# EAGLE design CZTBoardV3 (EAGLE 9.6.2)
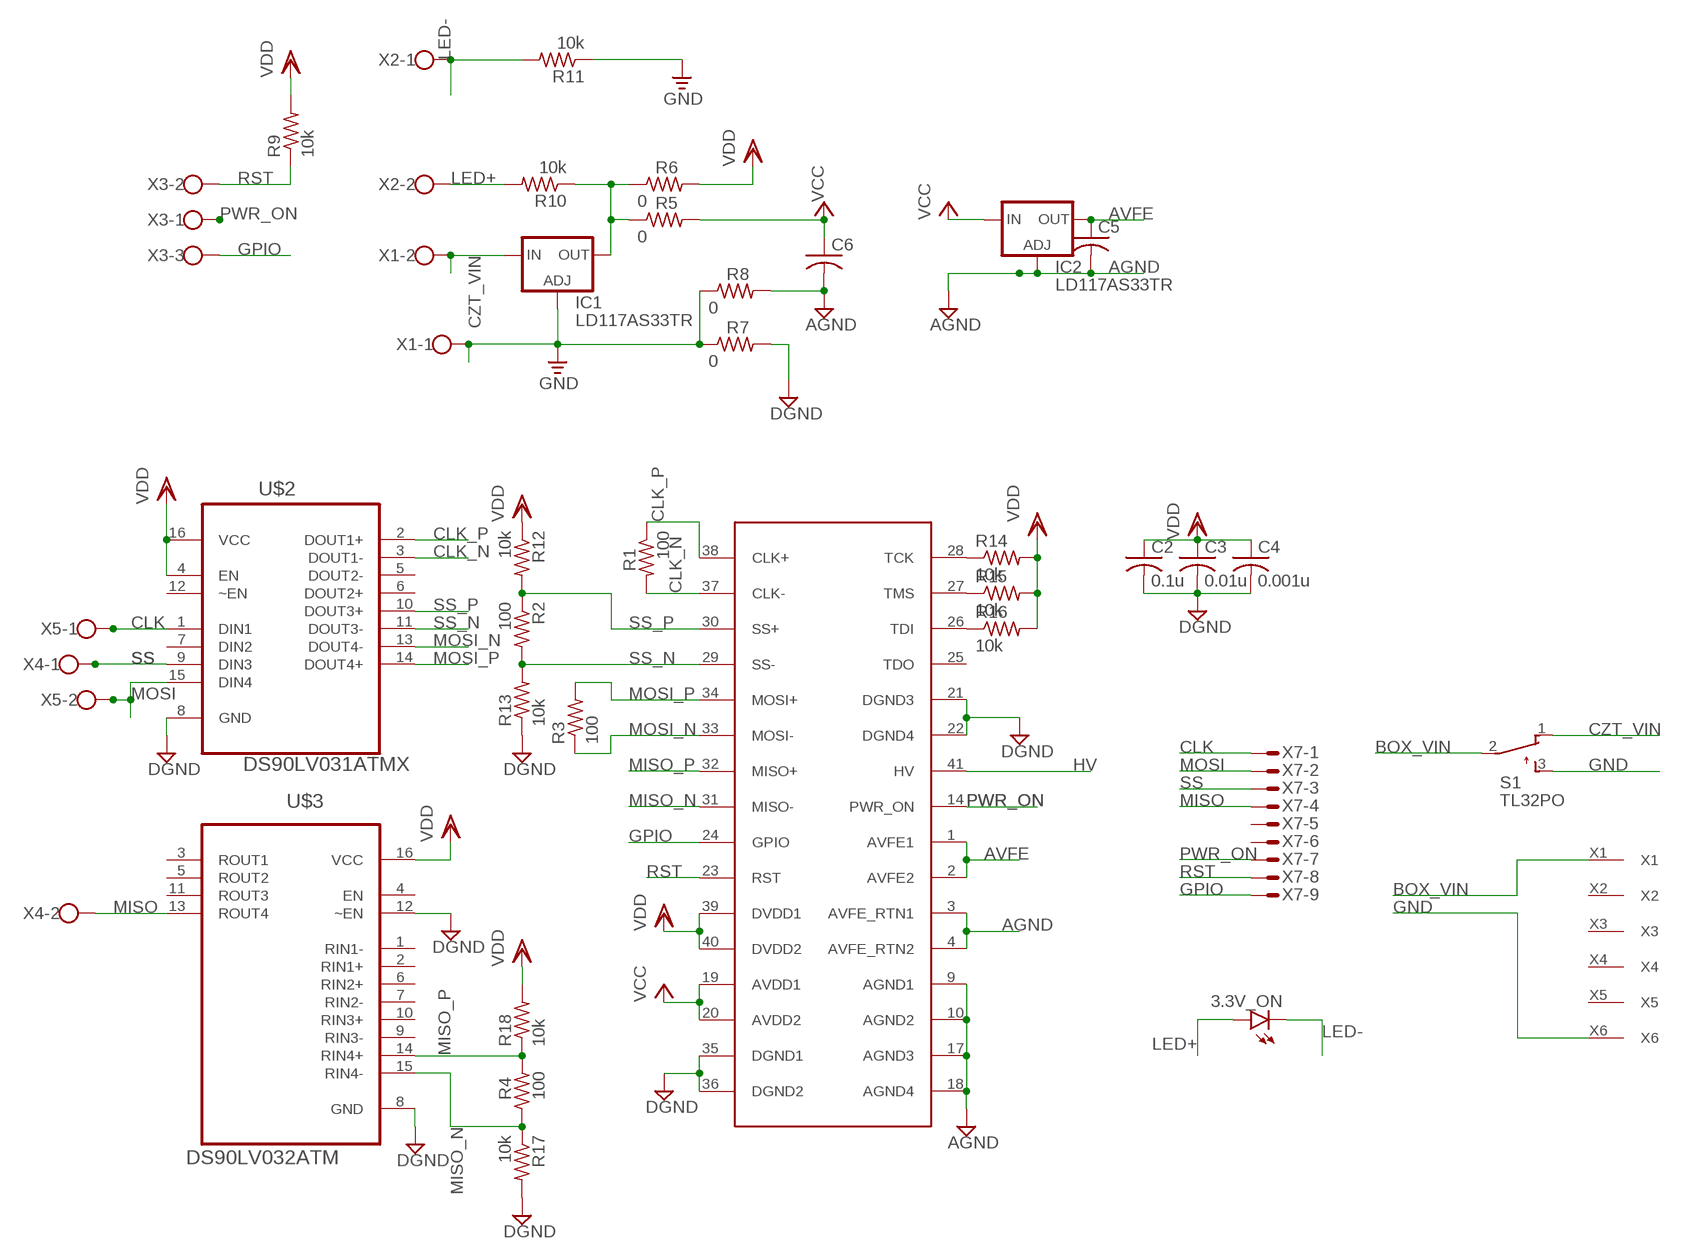
[diagram p0: schematic, sheet 1]

## Parts
3.3V_ON  LED3MM  [LED3MM]
C2  0.1u  C-USC0805K  [C0805K]
C3  0.01u  C-USC0805K  [C0805K]
C4  0.001u  C-USC0805K  [C0805K]
C5  C-USC0805K  [C0805K]
C6  C-USC0805K  [C0805K]
IC1  LD117AS33TR  [SOT223]
IC2  LD117AS33TR  [SOT223]
R1  100  R-US_R1206  [R1206]
R2  100  R-US_R1206  [R1206]
R3  100  R-US_R1206  [R1206]
R4  100  R-US_R1206  [R1206]
R5  0  R-US_R1206  [R1206]
R6  0  R-US_R1206  [R1206]
R7  0  R-US_R1206  [R1206]
R8  0  R-US_R1206  [R1206]
R9  10k  R-US_R1206  [R1206]
R10  10k  R-US_R1206  [R1206]
R11  10k  R-US_R1206  [R1206]
R12  10k  R-US_R1206  [R1206]
R13  10k  R-US_R1206  [R1206]
R14  10k  R-US_R1206  [R1206]
R15  10k  R-US_R1206  [R1206]
R16  10k  R-US_R1206  [R1206]
R17  10k  R-US_R1206  [R1206]
R18  10k  R-US_R1206  [R1206]
S1  TL32PO  [TL3XPO]
U$1  ORBOTECH_OMS40G256  [ORBOTECH_OMS40G256]
U$2  DS90LV031ATMX  [SOIC127P600X175-16N]
U$3  DS90LV032ATM  [SOIC127P600X175-16N]
X1  W237-102  [W237-102]
X2  W237-102  [W237-102]
X3  W237-103  [W237-103]
X4  W237-102  [W237-102]
X5  W237-102  [W237-102]
X6  GX16  [GX16]
X7  M09VS  [M09V]

## Nets
3.3VREG: IC1.4(OUT) R5.1 R6.1 R10.1
AGND: C5.2 C6.2 IC2.1(ADJ) R8.2 U$1.3(AVFE_RTN1) U$1.4(AVFE_RTN2) U$1.9(AGND1) U$1.10(AGND2) U$1.17(AGND3) U$1.18(AGND4)
AVFE: C5.1 IC2.4(OUT) U$1.1(AVFE1) U$1.2(AVFE2)
BOX_VIN: S1.2(P) X6.X1
CLK: U$2.1(DIN1) X5.1 X7.1
CLK_N [Diff_Pairs]: R1.2 U$1.37(CLK-) U$2.3(DOUT1-)
CLK_P [Diff_Pairs]: R1.1 U$1.38(CLK+) U$2.2(DOUT1+)
CZT_VIN: IC1.3(IN) S1.1(O) X1.2
DGND: C2.2 C3.2 C4.2 R7.2 R13.1 R17.2 U$1.21(DGND3) U$1.22(DGND4) U$1.35(DGND1) U$1.36(DGND2) U$2.8(GND) U$3.8(GND) U$3.12(~EN)
GND: IC1.1(ADJ) R7.1 R8.1 R11.1 S1.3(S) X1.1 X6.X6
GPIO: U$1.24(GPIO) X3.3 X7.9
HV: U$1.41(HV)
LED+: 3.3V_ON.A R10.2 X2.2
LED-: 3.3V_ON.K(C) R11.2 X2.1
MISO: U$3.13(ROUT4) X4.2 X7.4
MISO_N [Diff_Pairs]: R4.1 R17.1 U$1.31(MISO-) U$3.15(RIN4-)
MISO_P [Diff_Pairs]: R4.2 R18.1 U$1.32(MISO+) U$3.14(RIN4+)
MOSI: U$2.15(DIN4) X5.2 X7.2
MOSI_N [Diff_Pairs]: R3.1 U$1.33(MOSI-) U$2.13(DOUT4-)
MOSI_P [Diff_Pairs]: R3.2 U$1.34(MOSI+) U$2.14(DOUT4+)
N$1: R14.1 U$1.28(TCK)
N$2: R15.1 U$1.27(TMS)
N$4: R16.1 U$1.26(TDI)
PWR_ON: U$1.14(PWR_ON) X3.1 X7.7
RST: R9.1 U$1.23(RST) X3.2 X7.8
SS: U$2.9(DIN3) X4.1 X7.3
SS_N [Diff_Pairs]: R2.2 R13.2 U$1.29(SS-) U$2.11(DOUT3-)
SS_P [Diff_Pairs]: R2.1 R12.2 U$1.30(SS+) U$2.10(DOUT3+)
VCC: C6.1 IC2.3(IN) R5.2 U$1.19(AVDD1) U$1.20(AVDD2)
VDD: C2.1 C3.1 C4.1 R6.2 R9.2 R12.1 R14.2 R15.2 R16.2 R18.2 U$1.39(DVDD1) U$1.40(DVDD2) U$2.4(EN) U$2.16(VCC) U$3.16(VCC)
Unconnected: U$1.25(TDO) U$2.5(DOUT2-) U$2.6(DOUT2+) U$2.7(DIN2) U$2.12(~EN) U$3.1(RIN1-) U$3.2(RIN1+) U$3.3(ROUT1) U$3.4(EN) U$3.5(ROUT2) U$3.6(RIN2+) U$3.7(RIN2-) U$3.9(RIN3-) U$3.10(RIN3+) U$3.11(ROUT3) X6.X2 X6.X3 X6.X4 X6.X5 X7.5 X7.6

## Library data of the parts
3.3V_ON = led:LED: LED OSRAM: - CHIPLED LG R971, LG N971, LY N971, LG Q971, LY Q971, LO R971, LY R971 LH N974, LH R974 LS Q976, LO Q976, LY Q976 LO Q996 - Hyper CHIPLED LW Q18S LB Q993, LB Q99A, LB R99A - SideLED LS A670, LO A670, LY A670, LG A670, LP A670 LB A673, LV A673, LT A673, LW A673 LH A674 LY A675 LS A676, LA A676, LO A676, LY A676, LW A676 LS A679, LY A679, LG A679 - Hyper Micro SIDELED® LS Y876, LA Y876, LO Y876, LY Y876 LT Y87S - SmartLED LW L88C, LW L88S LB L89C, LB L89S, LG L890 LS L89K, LO L89K, LY L89K LS L896, LA L896, LO L896, LY L896 - TOPLED LS T670, LO T670, LY T670, LG T670, LP T670 LSG T670, LSP T670, LSY T670, LOP T670, LYG T670 LG T671, LOG T671, LSG T671 LB T673, LV T673, LT T673, LW T673 LH T674 LS T676, LA T676, LO T676, LY T676, LB T676, LH T676, LSB T676, LW T676 LB T67C, LV T67C, LT T67C, LS T67K, LO T67K, LY T67K, LW E67C LS E67B, LA E67B, LO E67B, LY E67B, LB E67C, LV E67C, LT E67C LW T67C LS T679, LY T679, LG T679 LS T770, LO T770, LY T770, LG T770, LP T770 LB T773, LV T773, LT T773, LW T773 LH T774 LS E675, LA E675, LY E675, LS T675 LS T776, LA T776, LO T776, LY T776, LB T776 LHGB T686 LT T68C, LB T68C - Hyper Mini TOPLED® LB M676 - Mini TOPLED Santana® LG M470 LS M47K, LO M47K, LY M47K Source: http://www.osram.convergy.de LUXEON: - LUMILED® LXK2-PW12-R00, LXK2-PW12-S00, LXK2-PW14-U00, LXK2-PW14-V00 LXK2-PM12-R00, LXK2-PM12-S00, LXK2-PM14-U00 LXK2-PE12-Q00, LXK2-PE12-R00, LXK2-PE12-S00, LXK2-PE14-T00, LXK2-PE14-U00 LXK2-PB12-K00, LXK2-PB12-L00, LXK2-PB12-M00, LXK2-PB14-N00, LXK2-PB14-P00, LXK2-PB14-Q00 LXK2-PR12-L00, LXK2-PR12-M00, LXK2-PR14-Q00, LXK2-PR14-R00 LXK2-PD12-Q00, LXK2-PD12-R00, LXK2-PD12-S00 LXK2-PH12-R00, LXK2-PH12-S00 LXK2-PL12-P00, LXK2-PL12-Q00, LXK2-PL12-R00 Source: www.luxeon.com KINGBRIGHT: KA-3528ASYC Source: www.kingbright.com
C2-C6 = rcl:C-US: CAPACITOR, American symbol
IC1 IC2 = v-reg:LD117A?*: Low drop fixed and adjustable positive voltage regulators 1 A Source: http://www.st.com/stonline/products/literature/ds/7194/ld1117axx.pdf
R1-R18 = rcl:R-US_: RESISTOR, American symbol
S1 = switch:TL32PO: TINY SWITCH ON - MOM Source: http://www2.produktinfo.conrad.com/datenblaetter/700000-724999/705152-da-01-de-Subminiaturschalter_TL_36YO.pdf
U$1 = Orbotech_OMS40G256:ORBOTECH_OMS40G256
U$2 = DS90LV031ATMX:DS90LV031ATMX
U$3 = DS90LV032ATM:DS90LV032ATM
X1 X2 X4 X5 = con-wago-500:W237-102: WAGO SCREW CLAMP; MPN: 237-102; OC_FARNELL: unknown; OC_NEWARK: 70K9898
X3 = con-wago-500:W237-103: WAGO SCREW CLAMP; MPN: 237-103; OC_FARNELL: unknown; OC_NEWARK: 18M7116
X6 = TI_Downloaded:GX16
X7 = con-subd:M09?S: SUB-D; OC_FARNELL: unknown; OC_NEWARK: unknown

## Net classes
1 Diff_Pairs: width 0.61 mm

## Board
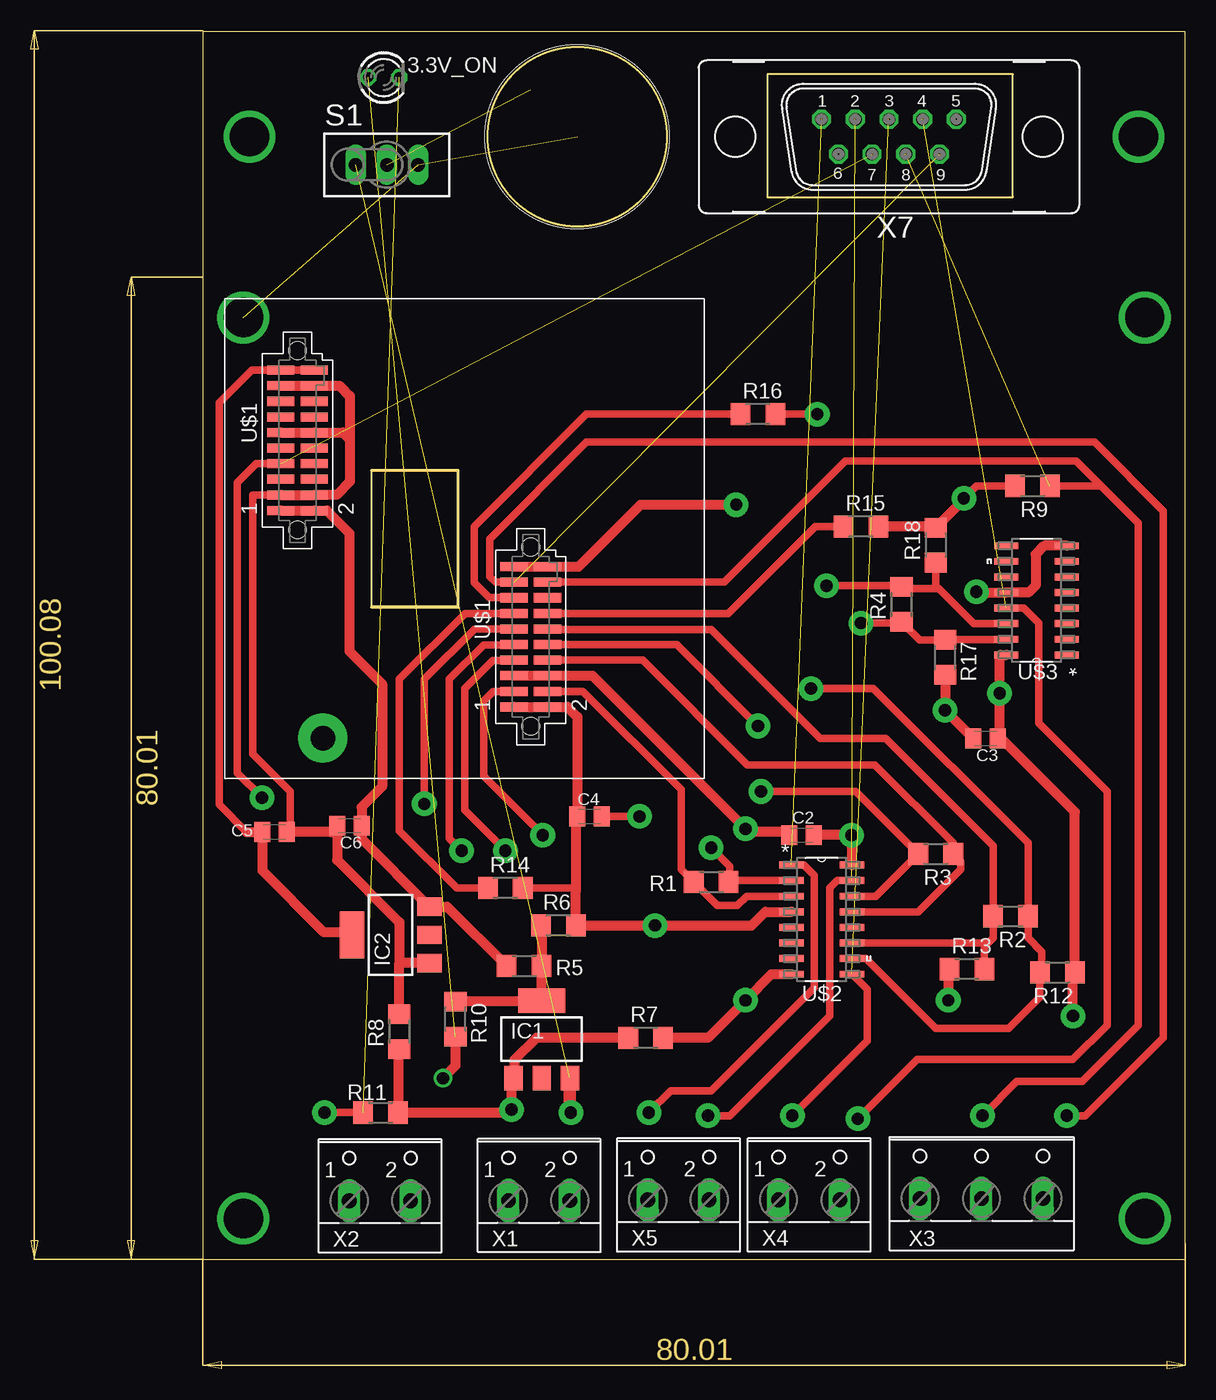
[diagram p1: board, top side]
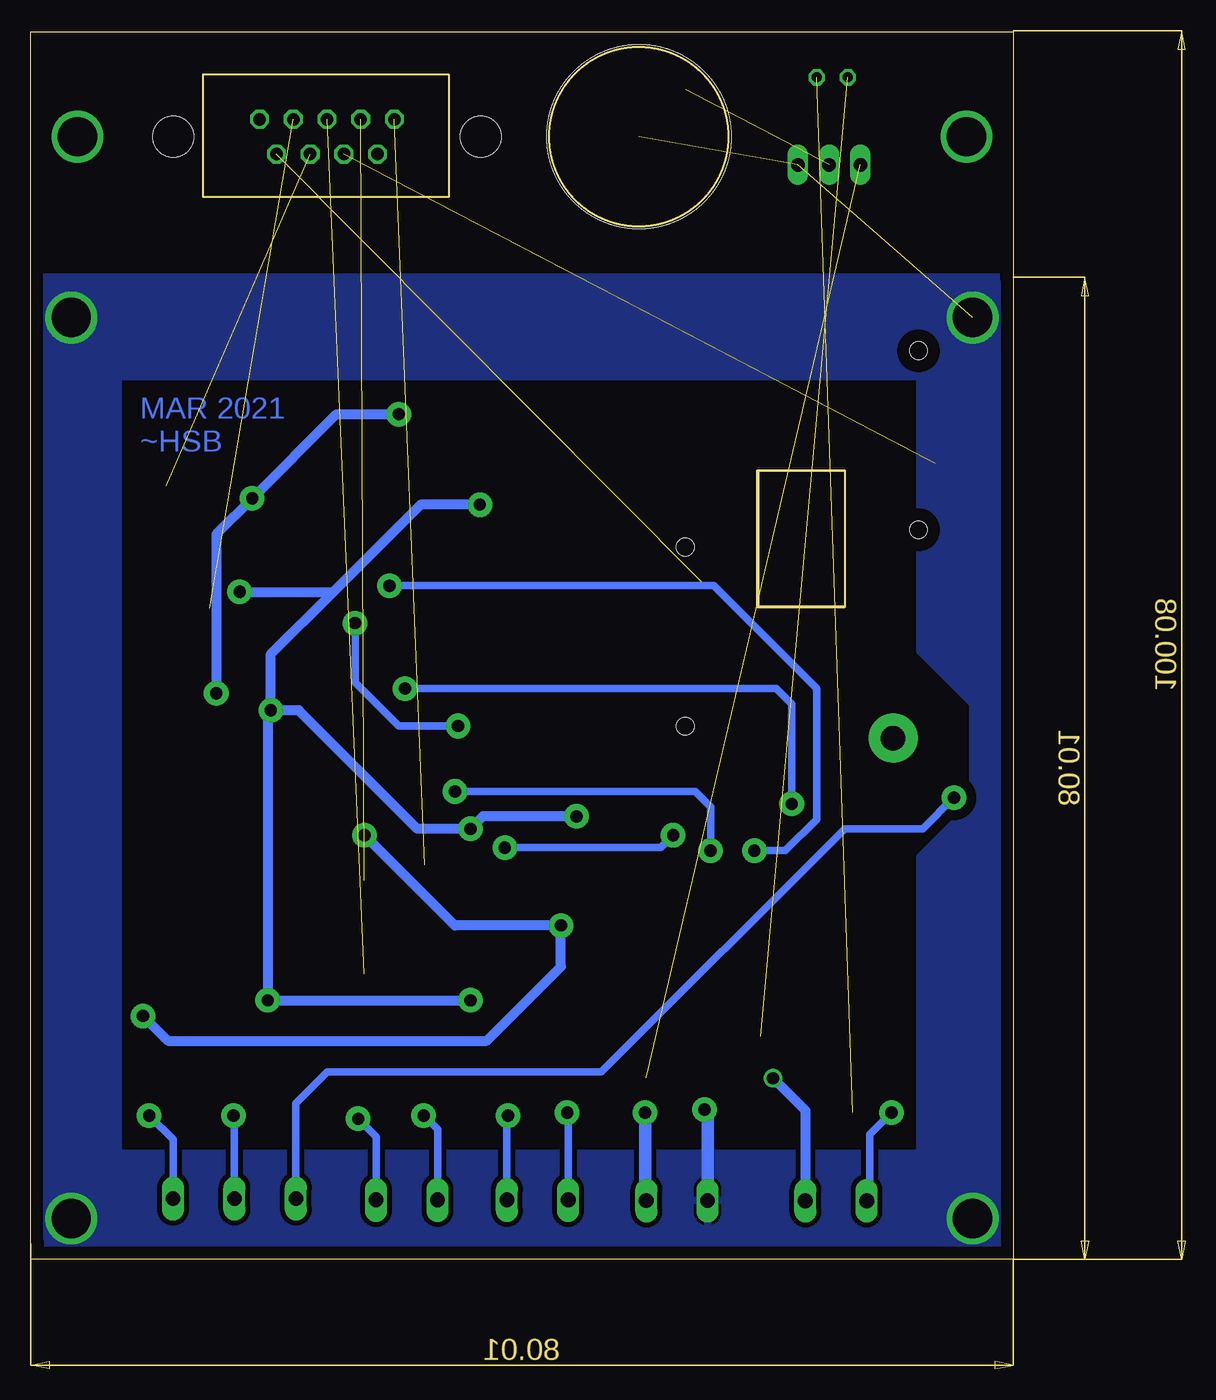
[diagram p2: board, bottom side, seen from below]

Size 80 x 100 mm. Coordinates in mm from the lower left corner, seen from the top.
Outline: 0,0 80,0 80,100 0,100 0,0
Copper layers (1*16): Top 0.035mm / dielectric 1.5mm / Bottom 0.035mm
Design rules "default": minimum track width 6mil, minimum drill 0.35mm, track to track 6mil, track to pad 6mil, pad to pad 6mil, via to via 6mil, smd to smd 6mil, copper to edge 40mil, drill to drill 6mil, minimum pad ring 10mil, minimum via ring 8mil, stop-mask expansion 4mil, vias tented up to drill 0mil, thermal gap 10mil
Milling: area 13.7,53.1 to 20.8,64.3; area 46,86.5 to 66,96.5

### Footprints (pad centres in the part's own frame; a part is rotated, then mirrored left to right if it is on the bottom)
LED3MM = drill 0.813 octagon: A -1.27,0; K 1.27,0
C0805K = smd 1.3 x 1.6: 1 -1,0; 2 1,0
SOT223 = smd 1.5 x 2: 1 -2.3,-3.15; 2 0,-3.15; 3 2.3,-3.15 | smd 3.8 x 2: 4 0,3.15
R1206 = smd 1.6 x 1.803: 1 -1.422,0; 2 1.422,0
TL3XPO = drill 1.1 pad 1.422 long: 1 -2.54,0; 2 0,0; 3 2.54,0
ORBOTECH_OMS40G256 = smd 0.737 x 2.222: 1 5.812,7.302; 2 5.812,4.571; 3 7.082,7.302; 4 7.082,4.571; 5 8.352,7.302; 6 8.352,4.571; 7 9.622,7.302; 8 9.622,4.571; 9 10.892,7.302; 10 10.892,4.571; 11 12.162,7.302; 12 12.162,4.571; 13 13.432,7.302; 14 13.432,4.571; 15 14.702,7.302; 16 14.702,4.571; 17 15.972,7.302; 18 15.972,4.571; 19 17.242,7.302; 20 17.242,4.571; 21 21.815,26.295; 22 21.815,23.565; 23 23.085,26.295; 24 23.085,23.565; 25 24.355,26.295; 26 24.355,23.565; 27 25.625,26.295; 28 25.625,23.565; 29 26.895,26.295; 30 26.895,23.565; 31 28.165,26.295; 32 28.165,23.565; 33 29.435,26.295; 34 29.435,23.565; 35 30.705,26.295; 36 30.705,23.565; 37 31.975,26.295; 38 31.975,23.565; 39 33.245,26.295; 40 33.245,23.565 | drill 2 pad 4: 41 35.78,8 | hole 1.422: 20.227,24.93; 34.833,24.93; 4.224,5.936; 18.829,5.936
SOIC127P600X175-16N = smd 1.981 x 0.559: 1 -2.464,4.445; 2 -2.464,3.175; 3 -2.464,1.905; 4 -2.464,0.635; 5 -2.464,-0.635; 6 -2.464,-1.905; 7 -2.464,-3.175; 8 -2.464,-4.445; 9 2.464,-4.445; 10 2.464,-3.175; 11 2.464,-1.905; 12 2.464,-0.635; 13 2.464,0.635; 14 2.464,1.905; 15 2.464,3.175; 16 2.464,4.445
W237-102 = drill 1.194 long: 1 -2.5,-1.27; 2 2.5,-1.27
W237-103 = drill 1.194 long: 1 -5,-1.29; 2 0,-1.29; 3 5,-1.29
GX16 = drill 0.6 square: X1 -3.81,3.81; X2 -3.81,-2.54; X3 0,-5.08; X4 3.81,-2.54; X5 3.81,3.81; X6 0,0 | hole 15: 0,0
M09V = drill 1.016 octagon: 1 -5.486,1.422; 2 -2.743,1.422; 3 0,1.422; 4 2.743,1.422; 5 5.486,1.422; 6 -4.115,-1.422; 7 -1.372,-1.422; 8 1.372,-1.422; 9 4.115,-1.422 | hole 3.302: -12.522,0; 12.522,0

### Placement (x,y rotation side)
3.3V_ON  14.73,96.27 0 top
C2  48.77,34.54 180 top
C3  63.75,42.42 180 top
C4  31.5,36.07 0 top
C5  5.84,34.8 0 top
C6  11.94,35.31 180 top
IC1  27.6,17.91 0 top
IC2  15.3,26.41 90 top
R1  41.4,30.73 180 top
R2  65.79,27.94 180 top
R3  59.69,33.02 180 top
R4  56.9,53.34 90 top
R5  26.16,23.88 180 top
R6  28.96,27.18 0 top
R7  36.07,18.03 0 top
R8  16,18.54 90 top
R9  67.56,62.99 180 top
R10  20.57,19.56 270 top
R11  14.48,11.94 180 top
R12  69.6,23.37 180 top
R13  62.23,23.62 0 top
R14  24.64,30.23 0 top
R15  53.59,59.69 0 top
R16  45.21,68.83 0 top
R17  60.45,49.02 270 top
R18  59.69,58.17 90 top
S1  14.99,89.15 0 top
U$1  1.78,78.23 270 top
U$2  50.39,27.66 0 top
U$3  67.89,53.67 180 top
X1  27.38,6.05 0 top
X2  14.43,6.02 0 top
X3  63.41,6.22 0 top
X4  49.38,6.1 0 top
X5  38.73,6.1 0 top
X6  30.48,91.44 0 top
X7  55.88,91.44 0 top

### Tracks (layer width: path | path; a pad name or v marks a point on that pad's centre or on a via)
3.3VREG
  Top 0.813: R6.1 27.58,27.13 R5.1 27.6,23.86 IC1.4 27.52,20.98 R10.1
AGND
  Top 0.61: U$1.18 4.09,62.26 4.06,62.23 4.06,41.15 7.11,38.1 7.11,35.07 C5.2
  Top 0.813: U$1.18 U$1.17 10.89,62.26 11.98,63.35 11.98,66.76 | U$1.10 U$1.9 11.4,67.34 11.98,66.76 | U$1.4 U$1.3 11.15,71.15 11.98,70.31 11.98,66.76 | C5.2 10.43,34.8 C6.2 10.94,32.51 16,27.45 16,24.11 | IC2.1 16,24.11 | R8.2 16,24.11
AVFE
  Top 0.61: U$1.1 U$1.2 3.97,72.42 1.32,69.77 1.32,37.03 3.56,34.8
  Top 0.813: 3.56,34.8 C5.1 4.84,31.65 9.87,26.63 11.93,26.63 IC2.4
BOX_VIN  (1 unrouted)
CLK  (via drill 1 pad 2)  (1 unrouted)
  Top 0.61: U$2.1 48.92,32.11 49.78,31.24 49.78,22.1 41.4,13.72 38.1,13.72 v36.32,11.94
  Bottom 0.61: X5.1 36.23,11.85
  Bottom 0.813: 36.23,11.85 v36.32,11.94
CLK_N
  Top 0.61: U$2.3 44.3,29.57 43.54,28.8 41.91,28.8 R1.2 38.96,31.75 38.96,38.25 30.96,46.26 U$1.37
CLK_P  (via drill 1 pad 2)
  Top 0.61: U$1.38 23.65,46.26 22.86,45.47 22.86,39.37 v27.69,34.54 | U$2.2 42.93,30.84 | 42.93,30.84 R1.1 42.93,30.84 | 42.93,30.84 42.93,32 v41.4,33.53
  Bottom 0.61: v41.4,33.53 28.7,33.53 v27.69,34.54
CZT_VIN  (via drill 1 pad 2)  (1 unrouted)
  Top 0.813: 29.88,14.74 IC1.3
  Top 1.016: 29.88,14.74 29.88,12.03 v29.97,11.94
  Bottom 1.016: v29.97,11.94 29.97,4.87 X1.2
DGND  (via drill 1 pad 2)
  Top 0.61: C4.2 v35.56,36.07
  Top 0.813: U$1.22 U$1.21 30.61,56.42 35.66,61.47 v43.43,61.47 | U$2.8 46.33,23.22 v44.2,21.08 41.15,18.03 R7.2 | R13.1 60.71,23.52 v60.71,21.08 | R17.2 v60.45,44.7 60.47,44.7 C3.2 | U$3.8 68.53,58.12 67.82,57.4 67.82,54.86 67.26,54.3 U$3.12 63.04,54.3 v62.99,54.36 | C2.2 47.51,34.8 44.45,34.8 v44.2,35.05 31.72,47.53 U$1.35 U$1.36
  Bottom 0.813: v60.45,44.7 60.71,44.45 v60.71,21.08 v44.2,21.08 | v60.45,44.7 58.17,44.7 48.51,35.05 v44.2,35.05 43.18,36.07 v35.56,36.07 | v43.43,61.47 48.26,61.47 55.37,54.36 | v60.45,44.7 60.45,49.28 55.37,54.36 | v62.99,54.36 55.37,54.36
GND  (via drill 1 pad 2, 3.2)  (2 unrouted)
  Top 0.813: R8.1 15.9,17.02 R11.1 24.89,11.94 v25.15,12.19 25.15,14.61 IC1.1 25.4,14.86 25.4,16.26 27.18,18.03 R7.1
  Bottom 0.813: 25.14,12.18 v25.15,12.19
  Bottom 1.016: X1.1 24.88,11.93 25.14,12.18
  other vias: 76.71,76.71 3.3,76.71 76.71,3.3 3.3,3.3
  pour Bottom (isolate 0.406): 0.25,-0.25 80.01,-0.25 80.26,0 80.26,8.64 0,8.64 -0.05,8.59
  pour Bottom (isolate 0.406): 80.26,0.25 80.26,80.01 72.9,80.01 72.9,-0.24
  pour Bottom (isolate 0.406): 0,80.01 80.01,80.01 80.26,79.76 80.26,71.88 0,71.88
  pour Bottom (isolate 0.813): 0,80.01 0,-0.51 7.37,-0.51 7.62,-0.25 7.62,32.77 6.1,34.29 3.3,37.08 3.3,39.12 3.3,45.21 7.62,49.53 7.62,80.01 0.51,80.01 0.25,79.76
GND5  (via drill 3.2)
  other vias: 76.2,91.44
GND6  (via drill 3.2)
  other vias: 3.81,91.44
GPIO  (via drill 1 pad 2)  (1 unrouted)
  Top 0.61: U$1.24 23.85,55.15 23.37,55.63 23.37,58.67 31.24,66.55 72.64,66.55 78.23,60.96 78.23,18.03 71.88,11.68 v70.36,11.68
  Bottom 0.61: v70.36,11.68 68.41,9.74 X3.3
LED+  (via drill 1)  (1 unrouted)
  Top 0.813: R10.2 20.57,15.75 v19.56,14.73
  Bottom 0.813: v19.56,14.73 16.93,12.1 X2.2
LED-  (via drill 1 pad 2)  (1 unrouted)
  Top 0.61: v9.91,11.94 R11.2
  Bottom 0.61: X2.1 11.67,5 11.67,10.17 v9.91,11.94
MISO  (via drill 1 pad 2)  (1 unrouted)
  Top 0.61: U$3.13 66.85,53.03 68.07,51.82 68.07,43.69 73.66,38.1 73.66,19.05 70.87,16.26 58.17,16.26 v53.34,11.43
  Bottom 0.61: X4.2 51.88,9.97 v53.34,11.43
MISO_N  (via drill 1 pad 2)
  Top 0.61: U$3.15 60.5,50.49 R17.1 58.37,50.44 R4.1 56.79,51.82 v53.59,51.82 | U$1.31 38.58,50.07 v45.21,43.43
  Bottom 0.61: v53.59,51.82 53.59,46.99 50.04,43.43 v45.21,43.43
MISO_P  (via drill 1 pad 2)
  Top 0.61: v50.8,54.86 56.79,54.86 R4.2 56.74,54.61 59.69,54.61 | R18.1 59.69,54.61 | U$3.14 62.79,51.77 59.94,54.61 59.69,54.61 | U$1.32 25.31,50.04 22.86,50.04 20.07,47.24 20.07,34.29 v21.08,33.27
  Bottom 0.61: v21.08,33.27 18.54,33.27 16,35.81 16,46.48 24.38,54.86 v50.8,54.86
MOSI  (via drill 1 pad 2)  (1 unrouted)
  Top 0.61: U$2.15 51.66,30.84 51.05,30.23 51.05,19.81 42.93,11.68 v41.15,11.68
  Bottom 0.61: X5.2 41.23,11.6 v41.15,11.68
MOSI_N
  Top 0.61: U$2.13 58.27,28.3 61.72,31.75 61.72,32.41 R3.1 61.11,33.88 54.74,40.26 44.35,40.26 35.81,48.8 U$1.33
MOSI_P  (via drill 1 pad 2)
  Top 0.61: U$2.14 54.81,29.57 R3.2 53.19,38.1 v45.47,38.1 | U$1.34 25.31,48.77 23.62,48.77 21.34,46.48 21.34,36.58 v24.64,33.27
  Bottom 0.61: v24.64,33.27 24.64,36.83 25.91,38.1 v45.47,38.1
N$1
  Top 0.61: U$1.28 21.36,52.61 16,47.24 16,34.9 20.68,30.23 R14.1
N$2
  Top 0.61: U$1.27 42.8,52.61 49.89,59.69 R15.1
N$4
  Top 0.61: R16.1 31.24,68.83 22.09,59.68 22.09,55.12 23.33,53.88 U$1.26
PWR_ON  (via drill 1 pad 2)  (1 unrouted)
  Top 0.61: U$1.14 4.35,64.8 2.79,63.25 2.79,39.62 v4.83,37.59
  Bottom 0.61: X3.1 58.42,12.7 55.88,15.24 33.53,15.24 13.72,35.05 7.37,35.05 v4.83,37.59
RST  (via drill 1 pad 2)  (1 unrouted)
  Top 0.61: U$1.23 42.45,55.15 52.32,65.02 71.12,65.02 73.15,62.99 | 73.15,62.99 76.2,59.94 76.2,19.05 71.63,14.48 66.29,14.48 v63.5,11.68 | R9.1 73.15,62.99
  Bottom 0.61: X3.2 63.41,11.6 v63.5,11.68
SS  (via drill 1 pad 2)  (1 unrouted)
  Top 0.61: U$2.9 54.1,21.97 54.1,17.78 v48.01,11.68
  Bottom 0.61: X4.1 46.88,10.56 v48.01,11.68
SS_N
  Top 0.61: 63.96,25.76 63.65,25.45 R13.2 | 63.96,25.76 64.36,26.16 R2.2 64.36,33.68 55.63,42.42 50.29,42.42 41.4,51.31 28.1,51.31 U$1.29 | U$2.11 63.96,25.76
SS_P  (via drill 1 pad 2)
  Top 0.61: U$2.10 54,24.49 59.69,18.8 65.63,18.8 68.17,21.34 R12.2 68.33,23.52 68.33,25.04 67.21,26.16 R2.1 67.21,33.88 54.61,46.48 v49.53,46.48 | U$1.30 22.13,51.34 18.03,47.24 v18.03,37.08
  Bottom 0.61: v18.03,37.08 18.03,45.21 19.3,46.48 v49.53,46.48
VCC
  Top 0.813: U$1.20 U$1.19 10.1,60.99 11.94,59.15 11.94,49.53 14.61,46.86 14.61,38.5 12.94,36.83 C6.1 12.94,34.22 IC2.3 19.91,28.71 R5.2
VDD  (via drill 1 pad 2)
  Top 0.61: R14.2 30.12,30.23 30.38,29.97 | v50.04,68.83 R16.2 | v61.98,61.98 62.99,62.99 R9.2 | C4.1 30.38,35.95
  Top 0.813: U$1.40 U$1.39 29.69,44.99 30.5,44.18 C4.1 | U$2.4 45.82,28.3 44.7,27.18 v36.83,27.18 R6.2 30.38,29.97 30.38,35.95 | v70.87,19.81 70.87,23.22 R12.1 71.02,36.42 65.02,42.42 C3.1 64.9,42.56 v64.9,46.1 64.9,49.08 65.01,49.19 64.97,49.23 U$3.16 | U$2.16 52.86,34.52 v52.83,34.54 C2.1 | R15.2 59.59,59.69 R18.2 61.98,61.87 v61.98,61.98
  Bottom 0.813: v70.87,19.81 68.83,17.78 42.87,17.78 36.83,23.82 v36.83,27.18 45.47,27.18 v52.83,34.54 | v64.9,46.1 64.9,59.05 v61.98,61.98 55.12,68.83 v50.04,68.83

### Text on the board
Bottom: MAR 2021 / ~HSB